# EAGLE design SteeringWheel (EAGLE 8.3.2)
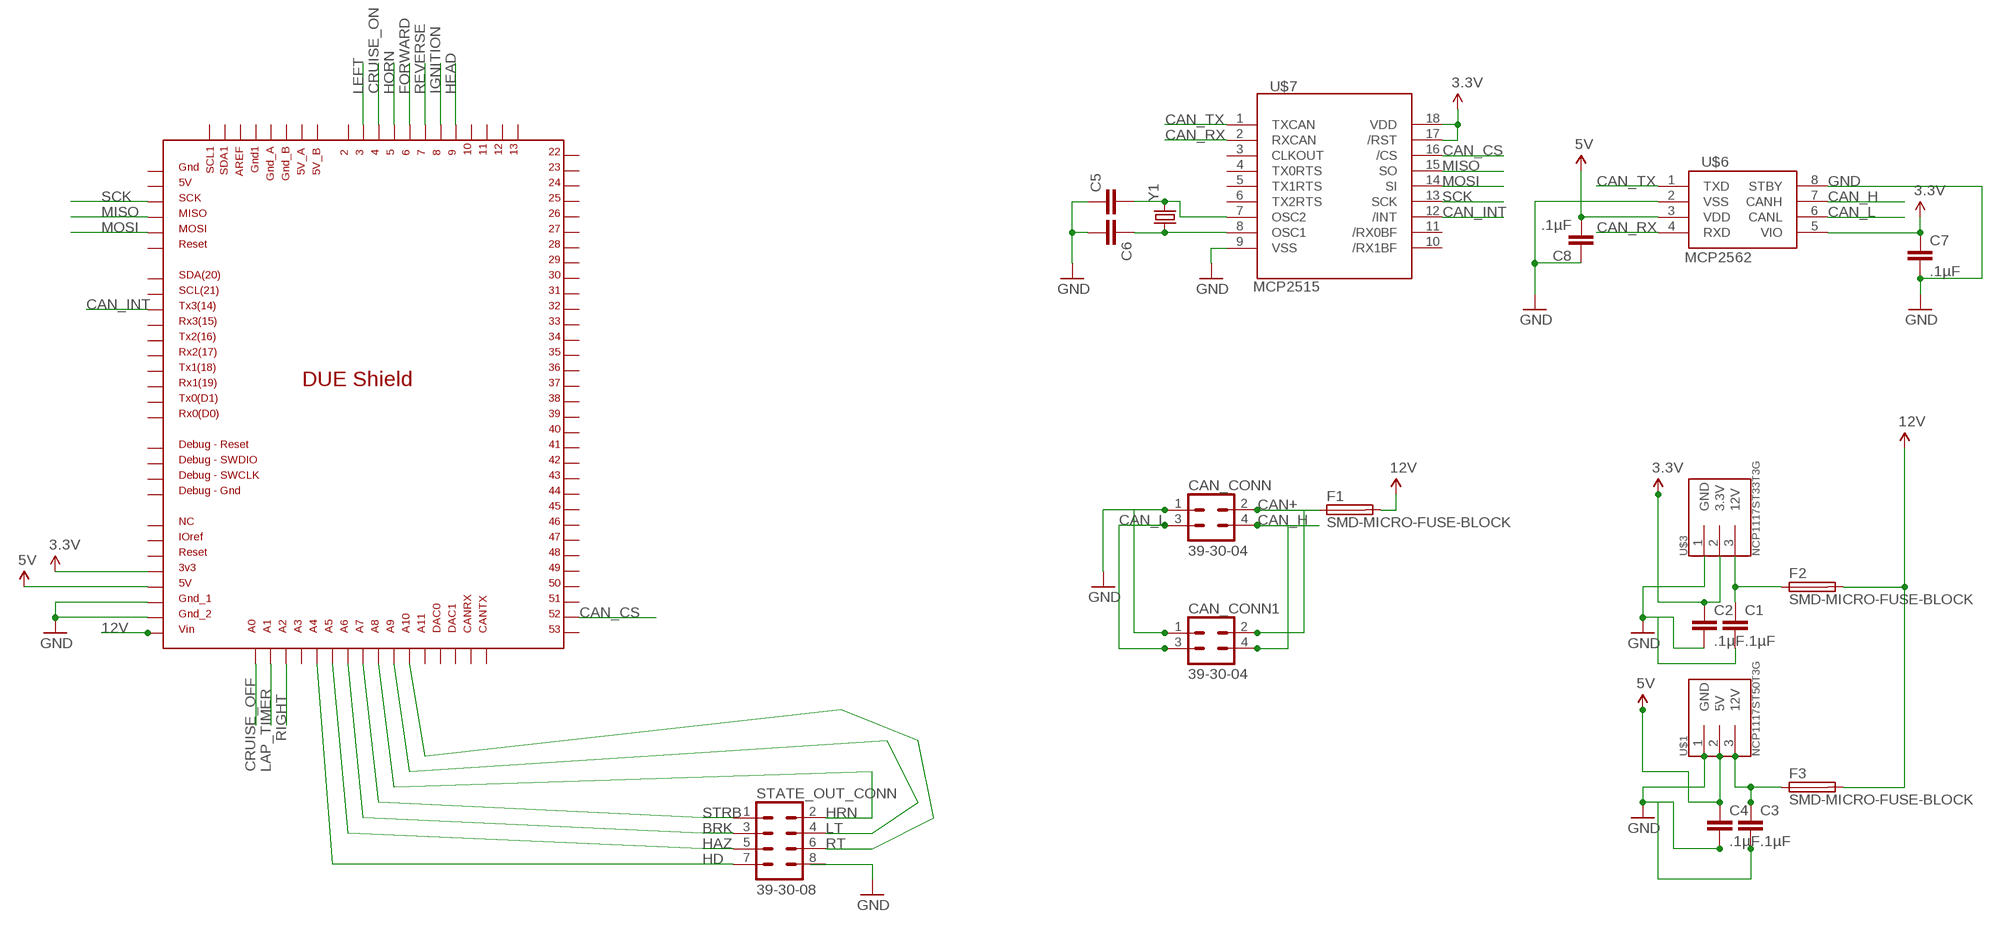
[diagram p0: schematic, sheet 1]

## Parts
C1  .1µF  CAP0805  [0805]
C2  .1µF  CAP0805  [0805]
C3  .1µF  CAP0805  [0805]
C4  .1µF  CAP0805  [0805]
C5  CAP0805  [0805]
C6  CAP0805  [0805]
C7  .1µF  CAP0805  [0805]
C8  .1µF  CAP0805  [0805]
CAN_CONN  39-30-04  [39-30-?04?]
CAN_CONN1  39-30-04  [39-30-?04?]
F1  SMD-MICRO-FUSE-BLOCK  [OMNIBLOK]
F2  SMD-MICRO-FUSE-BLOCK  [OMNIBLOK]
F3  SMD-MICRO-FUSE-BLOCK  [OMNIBLOK]
STATE_OUT_CONN  39-30-08  [39-30-?08?]
U$1  NCP1117ST50T3G  [SOT223]
U$2  DUE(NORMAL)  [DUE(NORMAL)]
U$3  NCP1117ST33T3G  [SOT223]
U$6  MCP2562  [SOIC8]
U$7  MCP2515  [SO-18W]
Y1  CRYSTALHC49US  [HC49US]

## Nets
3.3V: C2.1 C7.1 U$2.3V3 U$3.2(3.3V) U$6.5(VIO) U$7.17(/RST) U$7.18(VDD)
5V: C4.1 C8.2 U$1.2(5V) U$2.5V U$6.3(VDD)
12V: F1.P$2 F2.P$2 F3.P$2 U$2.VIN
BRK: STATE_OUT_CONN.3 U$2.A6
CAN+: CAN_CONN1.2 CAN_CONN.2 F1.P$1
CAN_CS: U$2.52 U$7.16(/CS)
CAN_H: CAN_CONN1.4 CAN_CONN.4 U$6.7(CANH)
CAN_INT: U$2.TX3 U$7.12(/INT)
CAN_L: CAN_CONN1.3 CAN_CONN.3 U$6.6(CANL)
CAN_RX: U$6.4(RXD) U$7.2(RXCAN)
CAN_TX: U$6.1(TXD) U$7.1(TXCAN)
CRUISE_OFF: U$2.A0
CRUISE_ON: U$2.4
FORWARD: U$2.6
GND: C1.2 C2.2 C3.2 C4.2 C5.1 C6.2 C7.2 C8.1 CAN_CONN1.1 CAN_CONN.1 U$1.1(GND) U$2.GND_1 U$2.GND_2 U$3.1(GND) U$6.2(VSS) U$6.8(STBY) U$7.9(VSS)
HAZ: STATE_OUT_CONN.5 U$2.A5
HD: STATE_OUT_CONN.7 U$2.A4
HEAD: U$2.9
HORN: U$2.5
HRN: STATE_OUT_CONN.2 U$2.A8
IGNITION: U$2.8
LAP_TIMER: U$2.A1
LEFT: U$2.3
LT: STATE_OUT_CONN.4 U$2.A9
MISO: U$2.MISO_ICSP U$7.15(SO)
MOSI: U$2.MOSI_ICSP U$7.14(SI)
N$1: C3.1 F3.P$1 U$1.3(12V)
N$2: C1.1 F2.P$1 U$3.3(12V)
N$7: C5.2 U$7.7(OSC2) Y1.2
N$11: C6.1 U$7.8(OSC1) Y1.1
REVERSE: U$2.7
RIGHT: U$2.A2
RT: STATE_OUT_CONN.6 U$2.A10
SCK: U$2.SCK_ICSP U$7.13(SCK)
STRB: STATE_OUT_CONN.1 U$2.A7
Unconnected: STATE_OUT_CONN.8 U$2.2 U$2.5V_A U$2.5V_B U$2.5V_ICSP U$2.10 U$2.11 U$2.12 U$2.13 U$2.22 U$2.23 U$2.24 U$2.25 U$2.26 U$2.27 U$2.28 U$2.29 U$2.30 U$2.31 U$2.32 U$2.33 U$2.34 U$2.35 U$2.36 U$2.37 U$2.38 U$2.39 U$2.40 U$2.41 U$2.42 U$2.43 U$2.44 U$2.45 U$2.46 U$2.47 U$2.48 U$2.49 U$2.50 U$2.51 U$2.53 U$2.A3 U$2.A11 U$2.AREF U$2.CANRX U$2.CANTX U$2.DAC0 U$2.DAC1 U$2.GND1 U$2.GND_A U$2.GND_B U$2.GND_DEBUG U$2.GND_ICSP U$2.IOREF U$2.NC U$2.RESET U$2.RESET_DEBUG U$2.RESET_ICSP U$2.RX0 U$2.RX1 U$2.RX2 U$2.RX3 U$2.SCL U$2.SCL1 U$2.SDA U$2.SDA1 U$2.SWCLK_DEBUG U$2.SWDIO_DEBUG U$2.TX0 U$2.TX1 U$2.TX2 U$7.3(CLKOUT) U$7.4(TX0RTS) U$7.5(TX1RTS) U$7.6(TX2RTS) U$7.10(/RX1BF) U$7.11(/RX0BF)

## Notes on the sheet
- CAN_INT
- CAN_CS
- STRB | HRN
- BRK | LT
- HAZ | RT
- HD

## Library data of the parts
C1-C8 = SparkFun-Capacitors:CAP: Capacitor Standard 0603 ceramic capacitor, and 0.1" leaded capacitor.
CAN_CONN CAN_CONN1 = con-molex-mini-fit:39-30-?04?: HEADER
F1-F3 = f-lf-omniblok-s:SMD-MICRO-FUSE
STATE_OUT_CONN = con-molex-mini-fit:39-30-?08?: HEADER
U$1 = NUSOLAR_Custom:NCP1117ST50T3G
U$2 = DUElib130425:DUE(NORMAL)
U$3 = NUSOLAR_Custom:NCP1117ST33T3G
U$6 = NUSOLAR_Custom:MCP2562
U$7 = NUSOLAR_Custom:MCP2515
Y1 = SparkFun-FreqCtrl:CRYSTAL: Various standard crystals. Proven footprints.

## Board
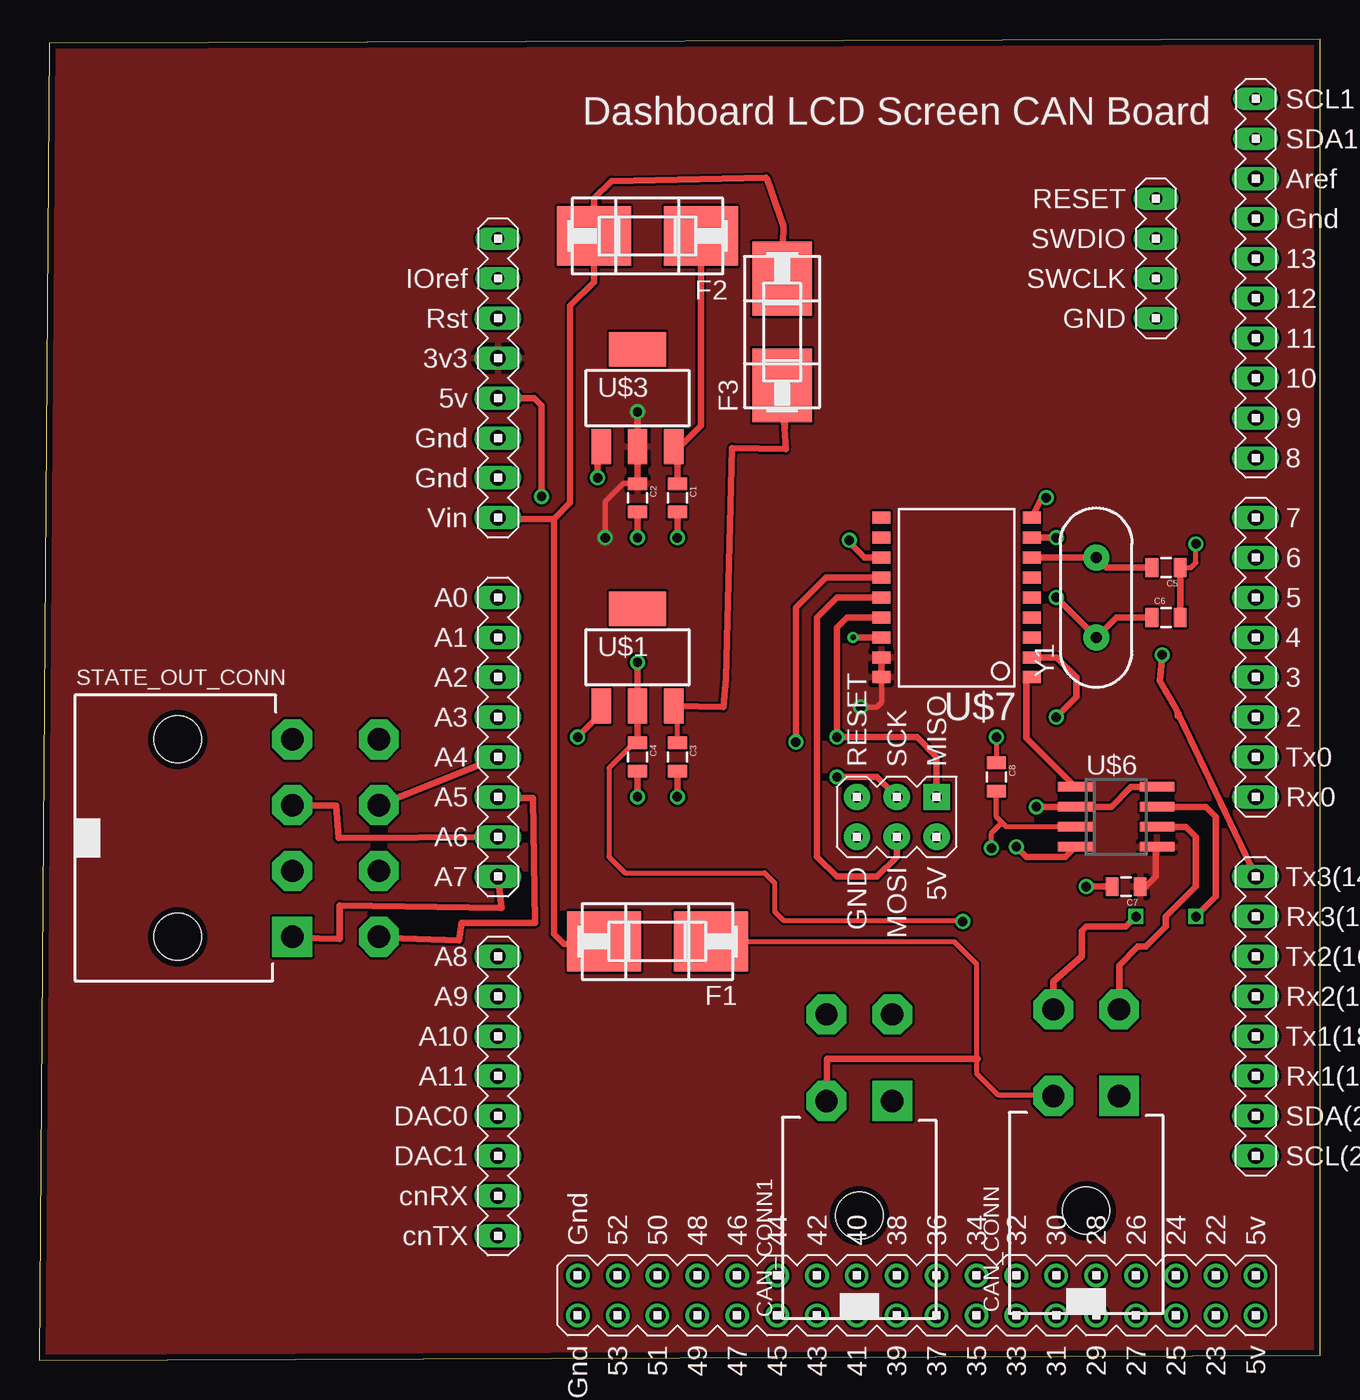
[diagram p1: board, top side]
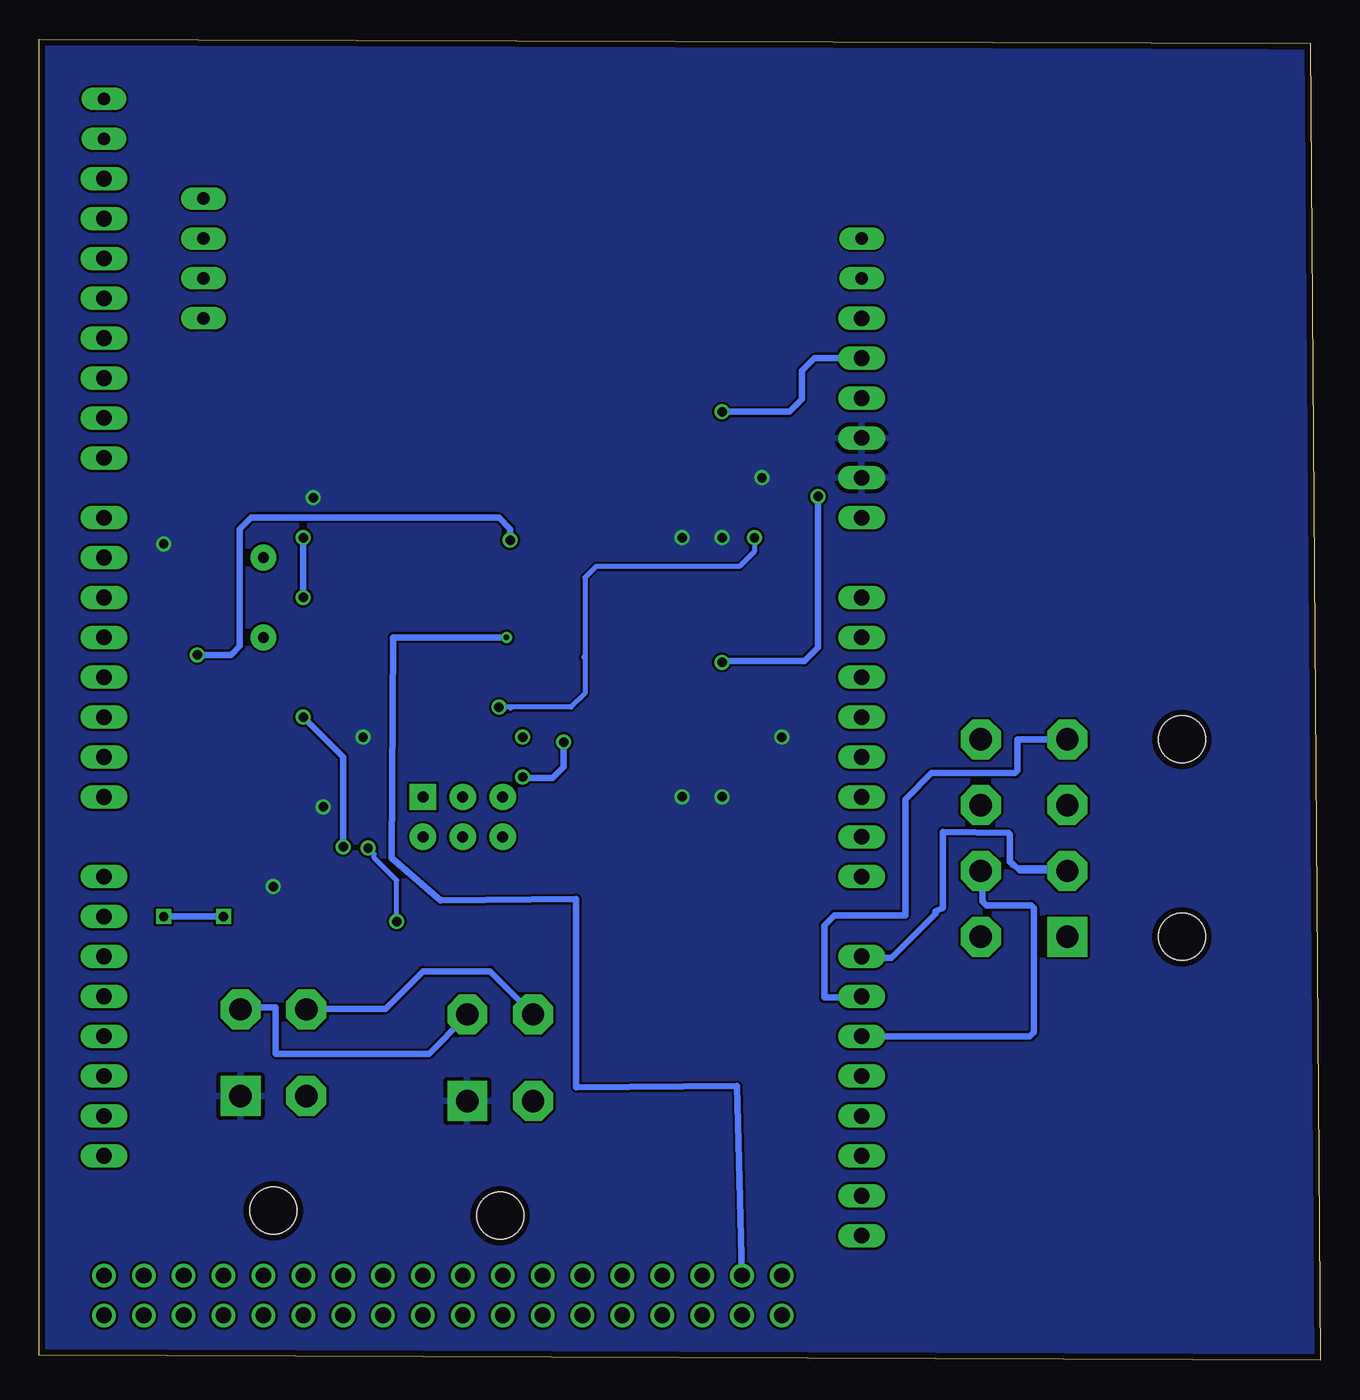
[diagram p2: board, bottom side, seen from below]

Size 81.58 x 84.13 mm. Coordinates in mm from the lower left corner, seen from the top.
Outline: 0,0 81.58,0.32 81.58,84.13 0.63,83.89 0,0
Copper layers (1*16): Top 0.0356mm / dielectric 1.5011mm / Bottom 0.0356mm
Design rules "LaenPCBOrder": minimum track width 6mil, minimum drill 13mil, track to track 6mil, track to pad 6mil, pad to pad 6mil, via to via 6mil, smd to smd 6mil, copper to edge 15mil, drill to drill 6mil, minimum pad ring 7mil, minimum via ring 7mil, stop-mask expansion 3mil, vias tented up to drill 0mil, thermal gap 10mil

### Footprints (pad centres in the part's own frame; a part is rotated, then mirrored left to right if it is on the bottom)
0805 = smd 0.8 x 1.2: 1 -0.9,0; 2 0.9,0
39-30-?04? = drill 1.422 pad 2.54 square: 1 2.095,0 | drill 1.422 pad 2.54 octagon: 2 -2.095,0; 3 2.095,5.512; 4 -2.095,5.512 | hole 3: 0,-7.3
OMNIBLOK = smd 4.7 x 3.8: P$1 -3.4,0; P$2 3.4,0
39-30-?08? = drill 1.422 pad 2.54 square: 1 6.287,0 | drill 1.422 pad 2.54 octagon: 2 2.095,0; 3 -2.095,0; 4 -6.287,0; 5 6.287,5.512; 6 2.095,5.512; 7 -2.095,5.512; 8 -6.287,5.512 | hole 3: -6.287,-7.3; 6.287,-7.3
SOT223 = smd 1.219 x 2.235: 1 -2.311,-3.099; 2 0,-3.099; 3 2.311,-3.099 | smd 3.6 x 2.2: 4 0,3.099
DUE(NORMAL) = drill 1 long: 2 -16.51,30.48; 3 -19.05,30.48; 3V3 -39.37,-17.78; 4 -21.59,30.48; 5 -24.13,30.48; 5V -36.83,-17.78; 6 -26.67,30.48; 7 -29.21,30.48; 8 -33.02,30.48; 9 -35.56,30.48; 10 -38.1,30.48; 11 -40.64,30.48; 12 -43.18,30.48; 13 -45.72,30.48; A0 -24.13,-17.78; A1 -21.59,-17.78; A2 -19.05,-17.78; A3 -16.51,-17.78; A4 -13.97,-17.78; A5 -11.43,-17.78; A6 -8.89,-17.78; A7 -6.35,-17.78; A8 -1.27,-17.78; A9 1.27,-17.78; A10 3.81,-17.78; A11 6.35,-17.78; AREF -50.8,30.48; CANRX 13.97,-17.78; CANTX 16.51,-17.78; DAC0 8.89,-17.78; DAC1 11.43,-17.78; GND1 -48.26,30.48; GND_1 -34.29,-17.78; GND_2 -31.75,-17.78; RESET -41.91,-17.78; RX0 -11.43,30.48; RX1 6.35,30.48; RX2 1.27,30.48; RX3 -3.81,30.48; SCL 11.43,30.48; SDA 8.89,30.48; TX0 -13.97,30.48; TX1 3.81,30.48; TX2 -1.27,30.48; TX3 -6.35,30.48; VIN -29.21,-17.78 | drill 1: 5V_A 19.05,30.48; 5V_B 21.59,30.48; 22 19.05,27.94; 23 21.59,27.94; 24 19.05,25.4; 25 21.59,25.4; 26 19.05,22.86; 27 21.59,22.86; 28 19.05,20.32; 29 21.59,20.32; 30 19.05,17.78; 31 21.59,17.78; 32 19.05,15.24; 33 21.59,15.24; 34 19.05,12.7; 35 21.59,12.7; 36 19.05,10.16; 37 21.59,10.16; 38 19.05,7.62; 39 21.59,7.62; 40 19.05,5.08; 41 21.59,5.08; 42 19.05,2.54; 43 21.59,2.54; 44 19.05,0; 45 21.59,0; 46 19.05,-2.54; 47 21.59,-2.54; 48 19.05,-5.08; 49 21.59,-5.08; 50 19.05,-7.62; 51 21.59,-7.62; 52 19.05,-10.16; 53 21.59,-10.16; GND_A 19.05,-12.7; GND_B 21.59,-12.7 | drill 0.7 pad 1.676: 5V_ICSP -8.89,5.08; GND_ICSP -8.89,10.16; MOSI_ICSP -8.89,7.62; RESET_ICSP -11.43,5.08; SCK_ICSP -11.43,7.62 | drill 0.8 pad 1.422 long: GND_DEBUG -41.91,24.13; IOREF -44.45,-17.78; NC -46.99,-17.78; RESET_DEBUG -49.53,24.13; SCL1 -55.88,30.48; SDA1 -53.34,30.48; SWCLK_DEBUG -44.45,24.13; SWDIO_DEBUG -46.99,24.13 | drill 0.7 pad 1.676 square: MISO_ICSP -11.43,10.16
SOIC8 = smd 0.6 x 2.2: 1 -1.905,-2.6; 2 -0.635,-2.6; 3 0.635,-2.6; 4 1.905,-2.6; 5 1.905,2.6; 6 0.635,2.6; 7 -0.635,2.6; 8 -1.905,2.6
SO-18W = smd 0.762 x 1.143: 1 -5.08,-4.788; 2 -3.81,-4.788; 3 -2.54,-4.788; 4 -1.27,-4.788; 5 0,-4.788; 6 1.27,-4.788; 7 2.54,-4.788; 8 3.81,-4.788; 9 5.08,-4.788; 10 5.08,4.788; 11 3.81,4.788; 12 2.54,4.788; 13 1.27,4.788; 14 0,4.788; 15 -1.27,4.788; 16 -2.54,4.788; 17 -3.81,4.788; 18 -5.08,4.788
HC49US = drill 0.7 pad 1.651: 1 -2.54,0; 2 2.54,0

### Placement (x,y rotation side)
C1  40.64,54.93 270 top
C2  38.1,54.93 270 top
C3  40.64,38.42 270 top
C4  38.1,38.42 270 top
C5  71.75,50.48 180 top
C6  71.75,47.31 0 top
C7  69.22,30.16 180 top
C8  60.96,37.15 270 top
CAN_CONN  39-30-04?  [39-30-?04?]  66.67,16.83 0 top
CAN_CONN1  39-30-04?  [39-30-?04?]  52.23,16.51 0 top
F1  39.37,26.67 180 top
F2  38.73,71.6 180 top
F3  47.31,65.48 90 top
STATE_OUT_CONN  39-30-08?  [39-30-?08?]  16.11,33.26 270 top
U$1  38.1,44.77 0 top
U$2  46.99,24.45 270 top
U$3  38.1,61.28 0 top
U$6  68.58,34.61 270 top
U$7  58.42,48.58 90 top
Y1  67.31,48.58 90 top

### Tracks (layer width: path | path; a pad name or v marks a point on that pad's centre or on a via)
3.3V  (via drill 0.6)
  Top 0.305: C2.1 37.17,55.83 36.04,54.69 v36.04,52.39 | v52.31,41.59 53.34,41.59 53.66,41.91 53.66,43.47 U$7.18
  Top 0.406: C2.1 U$3.2 v38.1,60.4 | U$7.18 U$7.17 | U$6.5 71.12,32.64 71.12,30.8 70.48,30.16 C7.1
  Bottom 0.305: v36.04,52.39 36.04,51.51 36.99,50.56 46.12,50.56 46.83,49.85 46.83,44.85 | 46.83,44.85 46.91,44.77 | 46.83,44.85 46.83,42.47 47.7,41.59 51.51,41.59 | 51.51,41.59 51.59,41.51 | 51.51,41.59 v52.31,41.59
  Bottom 0.406: U$2.3V3 32.23,63.82 33.02,63.02 33.02,61.2 33.81,60.4 v38.1,60.4
  pour Top: 0.71,83.74 81.28,84.14 81.28,0.32 0,0.08
5V  (via drill 0.6)
  Top 0.305: C4.1 37.89,39.32 36.27,37.7 36.27,32.07 37.31,31.04 46.2,31.04 46.83,30.4 46.83,28.58 47.39,28.02 58.58,28.02 58.74,27.86 v58.82,27.94 | U$6.3 61.59,33.97 61.32,34.25 | 61.32,34.25 60.96,34.61 C8.2 | v60.64,32.62 60.64,33.58 61.32,34.25
  Top 0.406: C4.1 U$1.2 v38.1,44.45 | U$2.5V 31.51,61.28 31.99,60.8 v31.99,55.01
  Bottom 0.305: v58.82,27.94 58.82,30.56 60.25,31.99 60.25,32.23 v60.64,32.62
  Bottom 0.406: 38.02,44.37 v38.1,44.45 38.02,44.53 32.86,44.53 31.99,45.4 v31.99,55.01
12V
  Top 0.152: 46.36,75.25 46.28,75.33
  Top 0.406: 46.36,75.25 47.4,72.23 F3.P$2 | 46.28,75.33 36.43,75.09 35.34,73.99 F2.P$2 35.34,68.67 33.81,67.15 33.81,54.61 32.78,53.58 | 32.78,53.58 29.29,53.58 U$2.VIN | 32.78,53.58 32.78,27.15 33.42,26.51 35.81,26.51 F1.P$2
BRK
  Top 0.152: U$2.A6 | 16.51,35.32 16.51,35.24 STATE_OUT_CONN.3
  Top 0.406: 16.03,35.32 16.51,35.32 18.89,35.32 19.05,33.26 U$2.A6 29.29,33.34
CAN+
  Top 0.152: 50.17,16.83 CAN_CONN1.2
  Top 0.305: F1.P$1 58.26,26.67 59.69,25.24 59.69,19.37 59.69,19.21 59.69,18.26 61.04,16.91 64.5,16.91 CAN_CONN.2
  Top 0.406: 50.17,16.51 50.17,16.83 50.17,19.21 59.69,19.21 59.77,19.21
CAN_CS  (via drill 0.35)
  Top 0.406: 53.66,46.04 U$7.16 v51.83,46.04
  Bottom 0.406: v51.83,46.04 59.06,46.04 59.13,31.99 56.04,29.29 47.39,29.37 47.39,17.38 37.15,17.46 U$2.52
CAN_H  (via drill 0.6)
  Top 0.406: U$6.7 74.3,35.24 74.93,34.61 74.93,29.53 v73.66,28.26 | v69.85,28.26 69.22,27.62 66.67,27.62 66.41,27.36 66.41,25.72 64.58,24.13 CAN_CONN.4
  Bottom 0.152: CAN_CONN1.4 50.17,21.91 50.17,22.07 | 64.14,22.38 64.14,22.54 CAN_CONN.4
  Bottom 0.406: v73.66,28.26 v69.85,28.26 | 64.61,22.38 64.14,22.38 59.53,22.38 57.15,24.77 52.86,24.77 50.17,22.07
CAN_INT  (via drill 0.6)
  Top 0.152: 72.94,40.28 73.03,40.32 72.39,40.96 72.39,41.59 72.34,41.56
  Top 0.406: U$7.12 52.55,51.12 51.59,52.07 v51.59,52.23 | v71.52,44.93 71.36,43.26 72.34,41.56 72.55,41.2 | 72.47,41.28 72.94,40.28 U$2.TX3
  Bottom 0.406: v51.59,52.23 51.59,52.94 52.31,53.66 68.1,53.66 68.82,52.94 68.82,45.48 69.37,44.93 71.36,44.93 71.52,44.77 v71.52,44.93
CAN_L
  Top 0.406: U$6.6 73.03,33.97 73.66,33.34 73.66,30.16 71.75,28.26 71.75,27.62 70.48,26.35 69.97,26.35 68.77,25.16 CAN_CONN.3
  Bottom 0.152: CAN_CONN1.3 54.61,21.91 54.49,21.79 | 68.58,22.46 68.58,22.54 CAN_CONN.3
  Bottom 0.406: 68.82,22.46 68.58,22.46 66.52,22.46 66.52,19.53 56.75,19.53 54.49,21.79 54.29,21.99
CAN_RX  (via drill 0.6)
  Top 0.406: U$7.2 64.77,44.77 66.04,43.5 66.04,42.23 v64.77,40.96 | v62.23,32.7 62.86,32.07 65.34,32.07 U$6.4
  Bottom 0.406: v64.77,40.96 62.23,38.42 v62.23,32.7
CAN_TX
  Top 0.406: U$7.1 62.86,43.5 62.86,39.63 U$6.1
GND  (via drill 0.6)
  Top 0.305: v60.96,39.69 C8.1 | C5.1 73.34,50.48 73.66,50.8 v73.66,51.99
  Top 0.406: U$3.1 35.56,57.95 v35.56,56.2 | C4.2 v38.1,35.88 | C3.2 v40.64,35.88 | v63.5,35.24 U$6.2 68.26,35.24 69.53,36.51 U$6.8 | C6.2 C5.1 | C7.2 v66.67,30.16 | U$7.9 63.84,54.93 v64.14,54.93 | U$1.1 35.79,41.19 v34.29,39.69 | C2.2 v38.1,52.39 | C1.2 v40.64,52.39
  pour Bottom: 0.4,83.26 81.28,84.14 81.28,0.32 0.16,-0.16
HAZ
  Top 0.152: U$2.A5 29.21,35.8 | 22.22,26.89 22.23,26.99 STATE_OUT_CONN.5
  Top 0.406: 21.59,26.91 22.22,26.89 26.75,26.75 26.91,27.86 31.59,27.86 31.43,35.8 29.21,35.8
HD
  Top 0.152: U$2.A4 29.22,38.39 | 21.59,35.32 21.59,35.24 STATE_OUT_CONN.7
  Top 0.406: 21.59,35.32 29.22,38.39 29.29,38.42
HRN
  Bottom 0.152: U$2.A8 29.21,25.64 | 19.56,31.57 19.69,31.43 16.51,31.43 STATE_OUT_CONN.2
  Bottom 0.406: 16.11,31.11 16.19,31.19 19.13,31.19 19.56,31.57 19.76,31.75 19.76,33.42 19.84,33.58 24.05,33.65 24.05,28.81 24.53,28.58 24.53,28.42 27.3,25.64 29.21,25.64
LT
  Bottom 0.152: U$2.A9 29.21,23.1 | 16.51,39.53 16.51,39.69 STATE_OUT_CONN.4
  Bottom 0.406: 16.11,39.53 16.51,39.53 19.29,39.53 19.29,37.54 19.45,37.39 24.77,37.39 26.43,35.72 26.43,28.34 30.96,28.34 31.59,27.7 31.59,23.1 29.21,23.1
MISO  (via drill 0.6)
  Top 0.406: U$7.15 51.44,47.31 50.8,46.67 v50.8,39.69 55.88,39.69 57.15,38.42 U$2.MISO_ICSP
MOSI
  Top 0.406: U$2.MOSI_ICSP 54.61,32.07 53.34,30.8 50.8,30.8 49.53,32.07 49.53,47.31 50.8,48.58 U$7.14
N$1
  Top 0.152: 46.99,61.28 46.99,61.91 F3.P$1 46.99,61.28 | 46.99,61.28 47.15,61.2 | 46.99,61.28 47.62,60.64 47.62,59.37 47.46,59.36
  Top 0.305: C3.1 40.64,41.44 U$1.3
  Top 0.406: 47.31,61.36 47.15,61.2 | U$1.3 43.57,41.59 43.74,43.42 44.13,58.1 47.55,58.02 47.46,59.36 47.31,61.6
N$2
  Top 0.406: U$3.3 40.64,58.18 40.64,58.02 | 40.64,58.02 C1.1 | F2.P$1 42.14,59.52 40.64,58.02
N$7
  Top 0.406: U$7.7 Y1.2 67.94,50.48 C5.2
N$11  (via drill 0.6)
  Top 0.406: v64.77,48.58 Y1.1 68.58,47.31 C6.1 | v64.77,52.39 U$7.8
  Bottom 0.406: v64.77,48.58 v64.77,52.39
RT
  Bottom 0.152: 21.51,30.8 21.59,30.8 STATE_OUT_CONN.6
  Bottom 0.406: 21.59,31.19 21.51,31.11 21.51,30.8 21.51,29.21 21.27,28.97 18.41,28.97 18.26,28.81 18.26,20.88 18.49,20.64 U$2.A10 29.29,20.64
SCK  (via drill 0.6)
  Top 0.406: U$2.SCK_ICSP 53.34,37.15 v50.8,37.15 | U$7.13 50.09,49.85 48.18,47.94 48.18,39.85 48.26,39.77 48.26,39.45 v48.18,39.37
  Bottom 0.406: v48.18,39.37 48.18,37.78 48.89,37.07 50.72,37.07 v50.8,37.15
STRB
  Top 0.152: U$2.A7 29.21,30.72 | 16.51,26.9 16.51,26.99 STATE_OUT_CONN.1
  Top 0.406: 16.11,26.91 16.51,26.9 19.13,26.83 19.13,28.97 29.45,28.81 29.21,30.72

### Text on the board
tPlace: Dashboard LCD Screen CAN Board